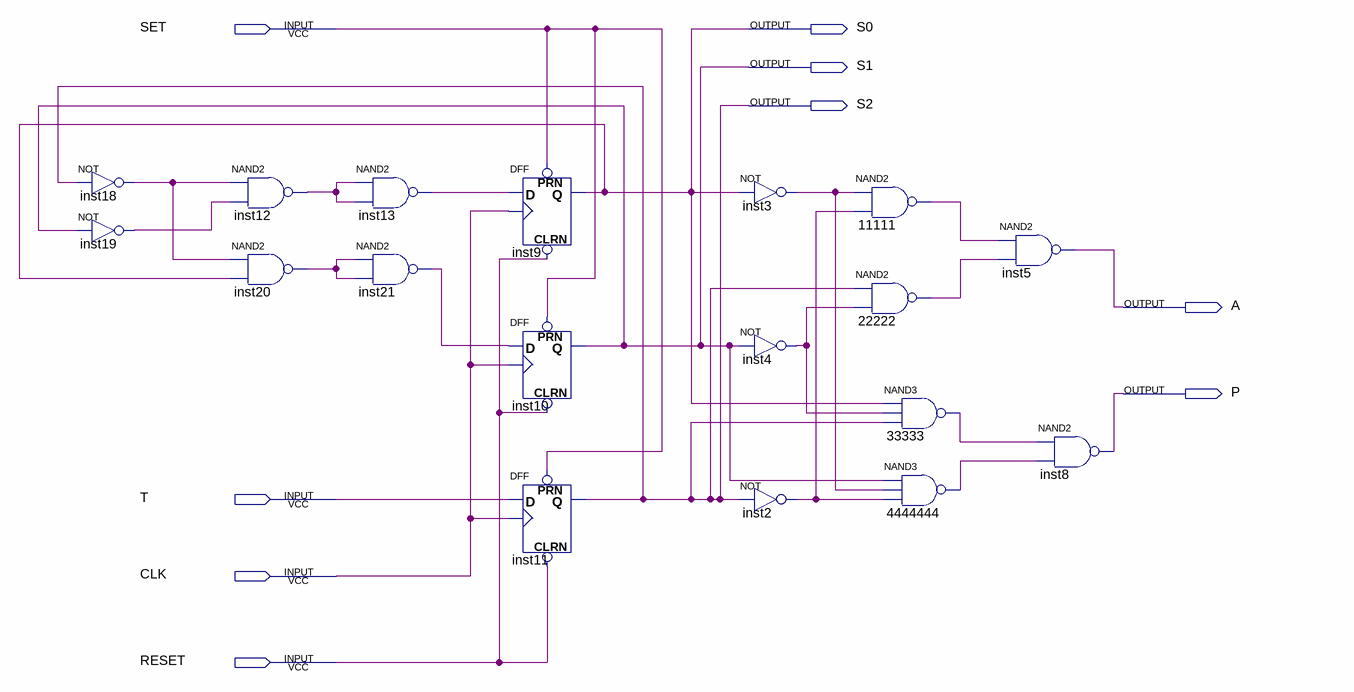
[diagram p0: schematic sheet]
// Quartus schematic lab7.bdf as structural Verilog: 18 symbols, 9 pins
module lab7 (
  input  SET,
  input  T,
  input  CLK,
  input  RESET,
  output S0,
  output S1,
  output S2,
  output A,
  output P
);

  wire inst2_out, inst3_out, inst4_out, inst12_out, inst13_out, inst18_out, inst19_out, inst20_out,
       inst21_out, n11111_out, n22222_out, n33333_out, n4444444_out;

  not inst18 (inst18_out, S2);
  not inst19 (inst19_out, S1);
  nand inst12 (inst12_out, inst18_out, inst19_out);
  nand inst20 (inst20_out, inst18_out, S0);
  nand inst13 (inst13_out, inst12_out, inst12_out);
  nand inst21 (inst21_out, inst20_out, inst20_out);
  DFF inst9 (.CLRN(RESET), .CLK(CLK), .D(inst13_out), .PRN(SET), .Q(S0));
  DFF inst10 (.CLRN(RESET), .CLK(CLK), .D(inst21_out), .PRN(SET), .Q(S1));
  DFF inst11 (.CLRN(RESET), .CLK(CLK), .D(T), .PRN(SET), .Q(S2));
  not inst3 (inst3_out, S0);
  not inst4 (inst4_out, S1);
  not inst2 (inst2_out, S2);
  nand u_11111 (n11111_out, inst3_out, inst2_out);
  nand u_22222 (n22222_out, S2, inst4_out);
  nand u_33333 (n33333_out, S0, inst4_out, S2);
  nand u_4444444 (n4444444_out, S1, inst3_out, inst2_out);
  nand inst5 (A, n11111_out, n22222_out);
  nand inst8 (P, n33333_out, n4444444_out);
endmodule
